# Altium schematic sheet TouchORkey.SchDoc
size A2
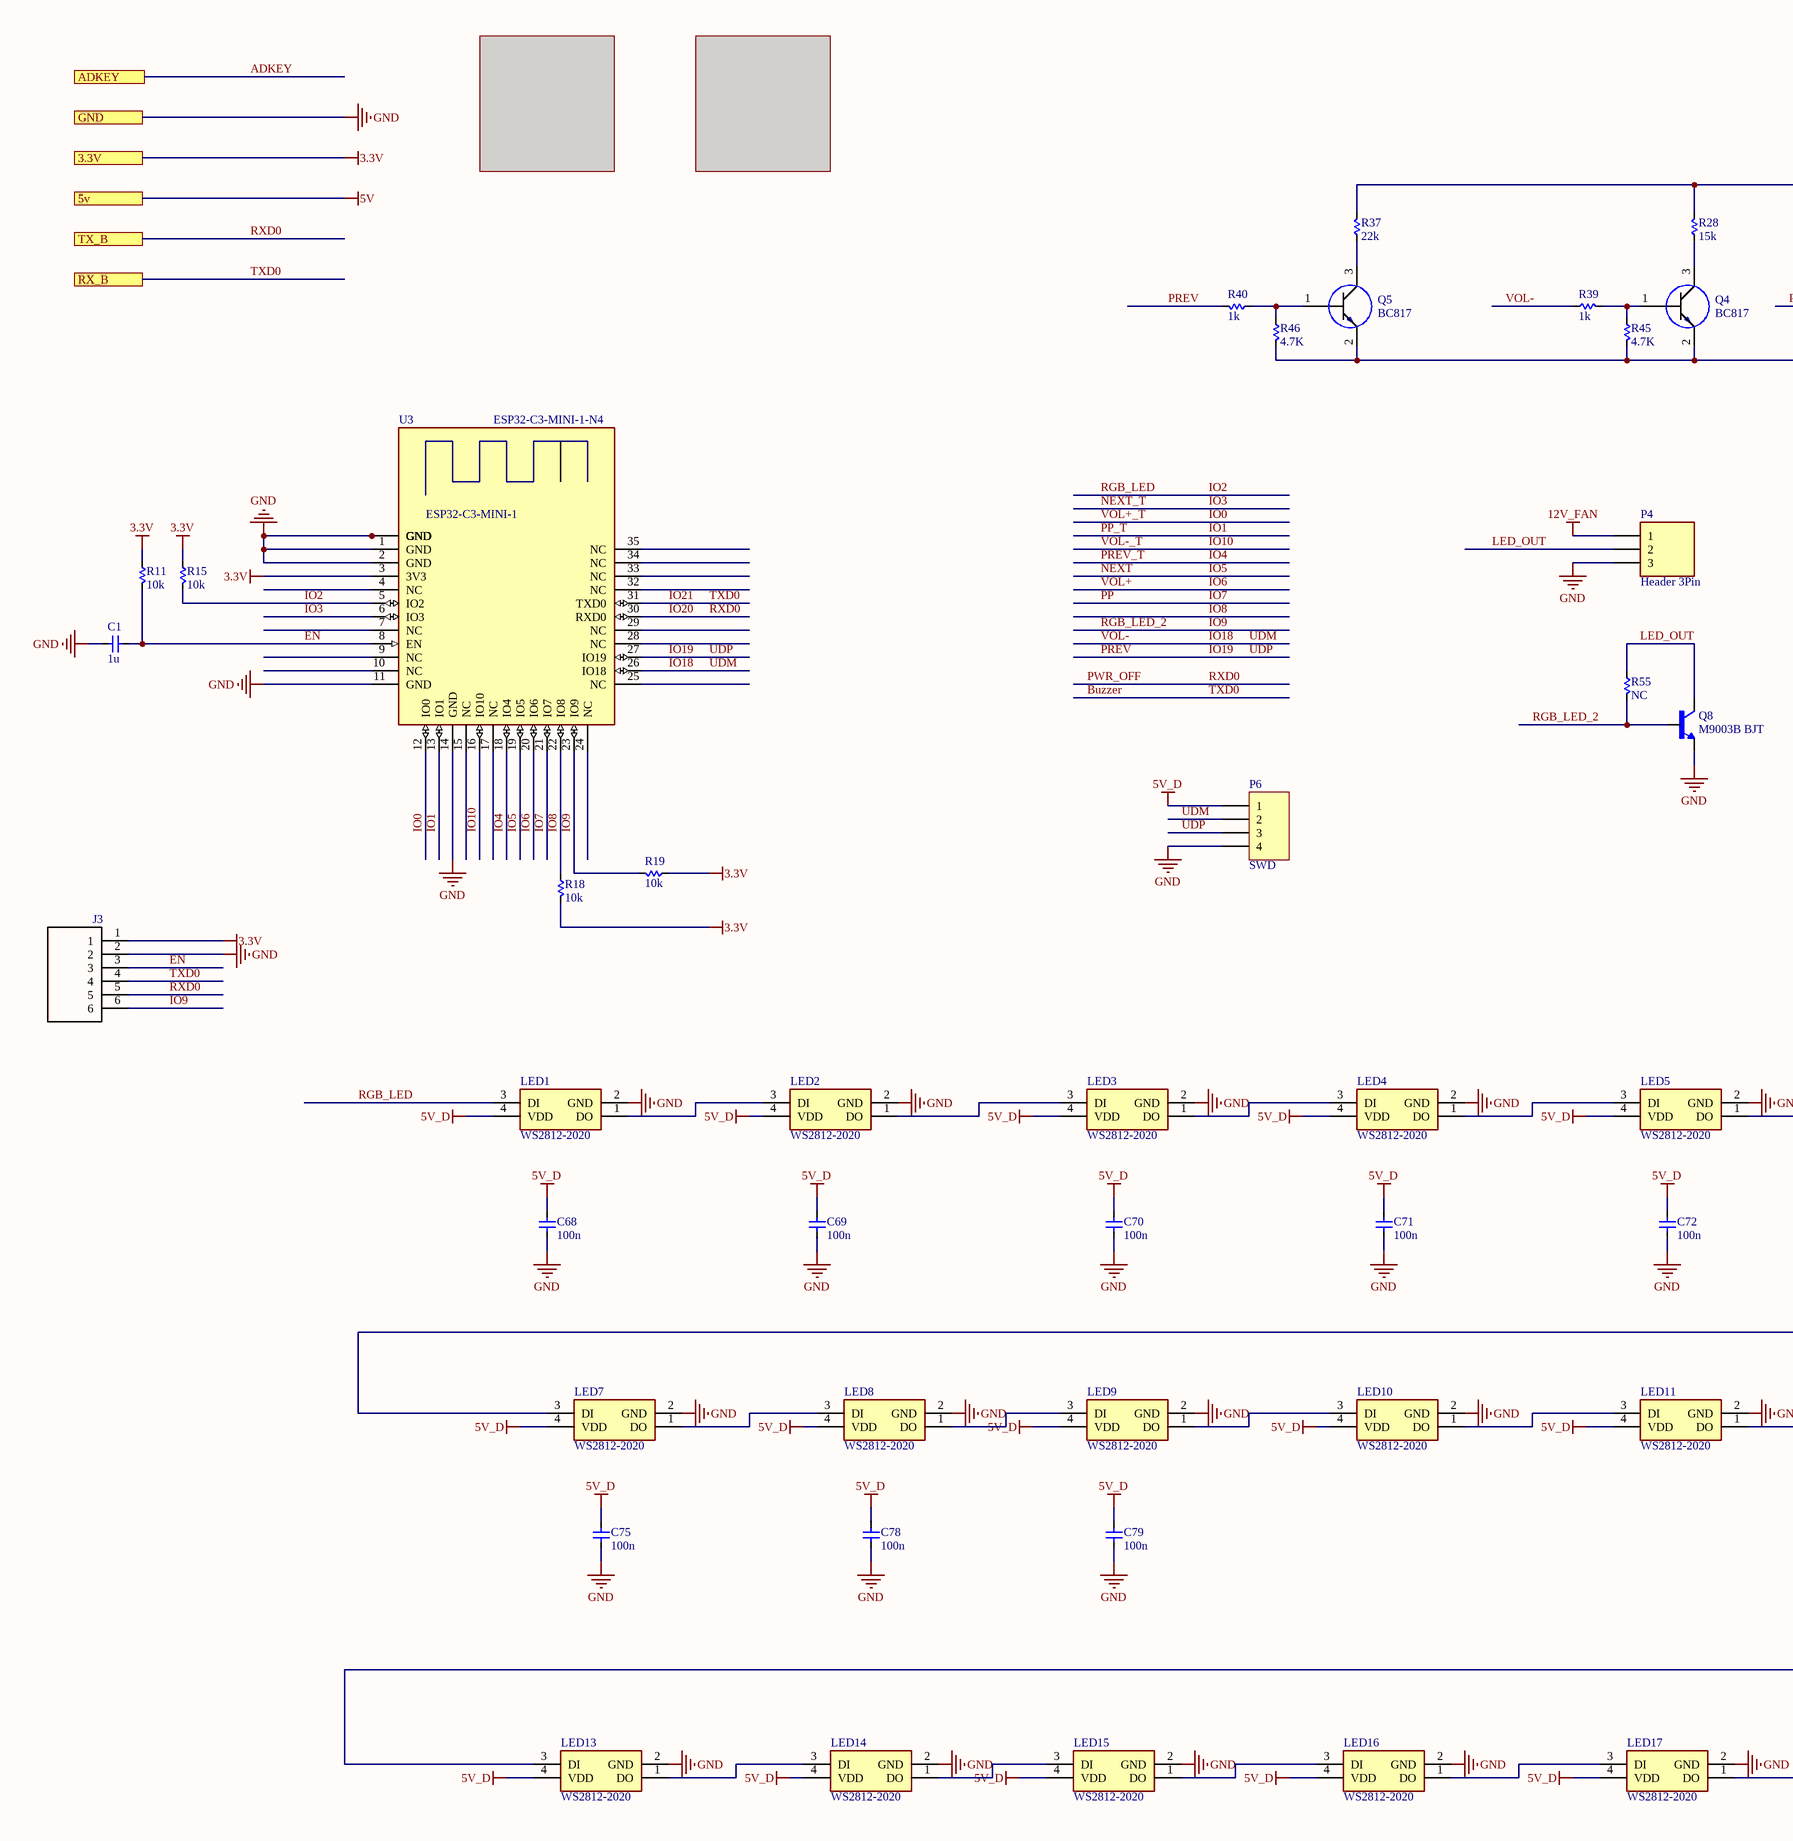
[diagram p0: TouchORkey.SchDoc, left]
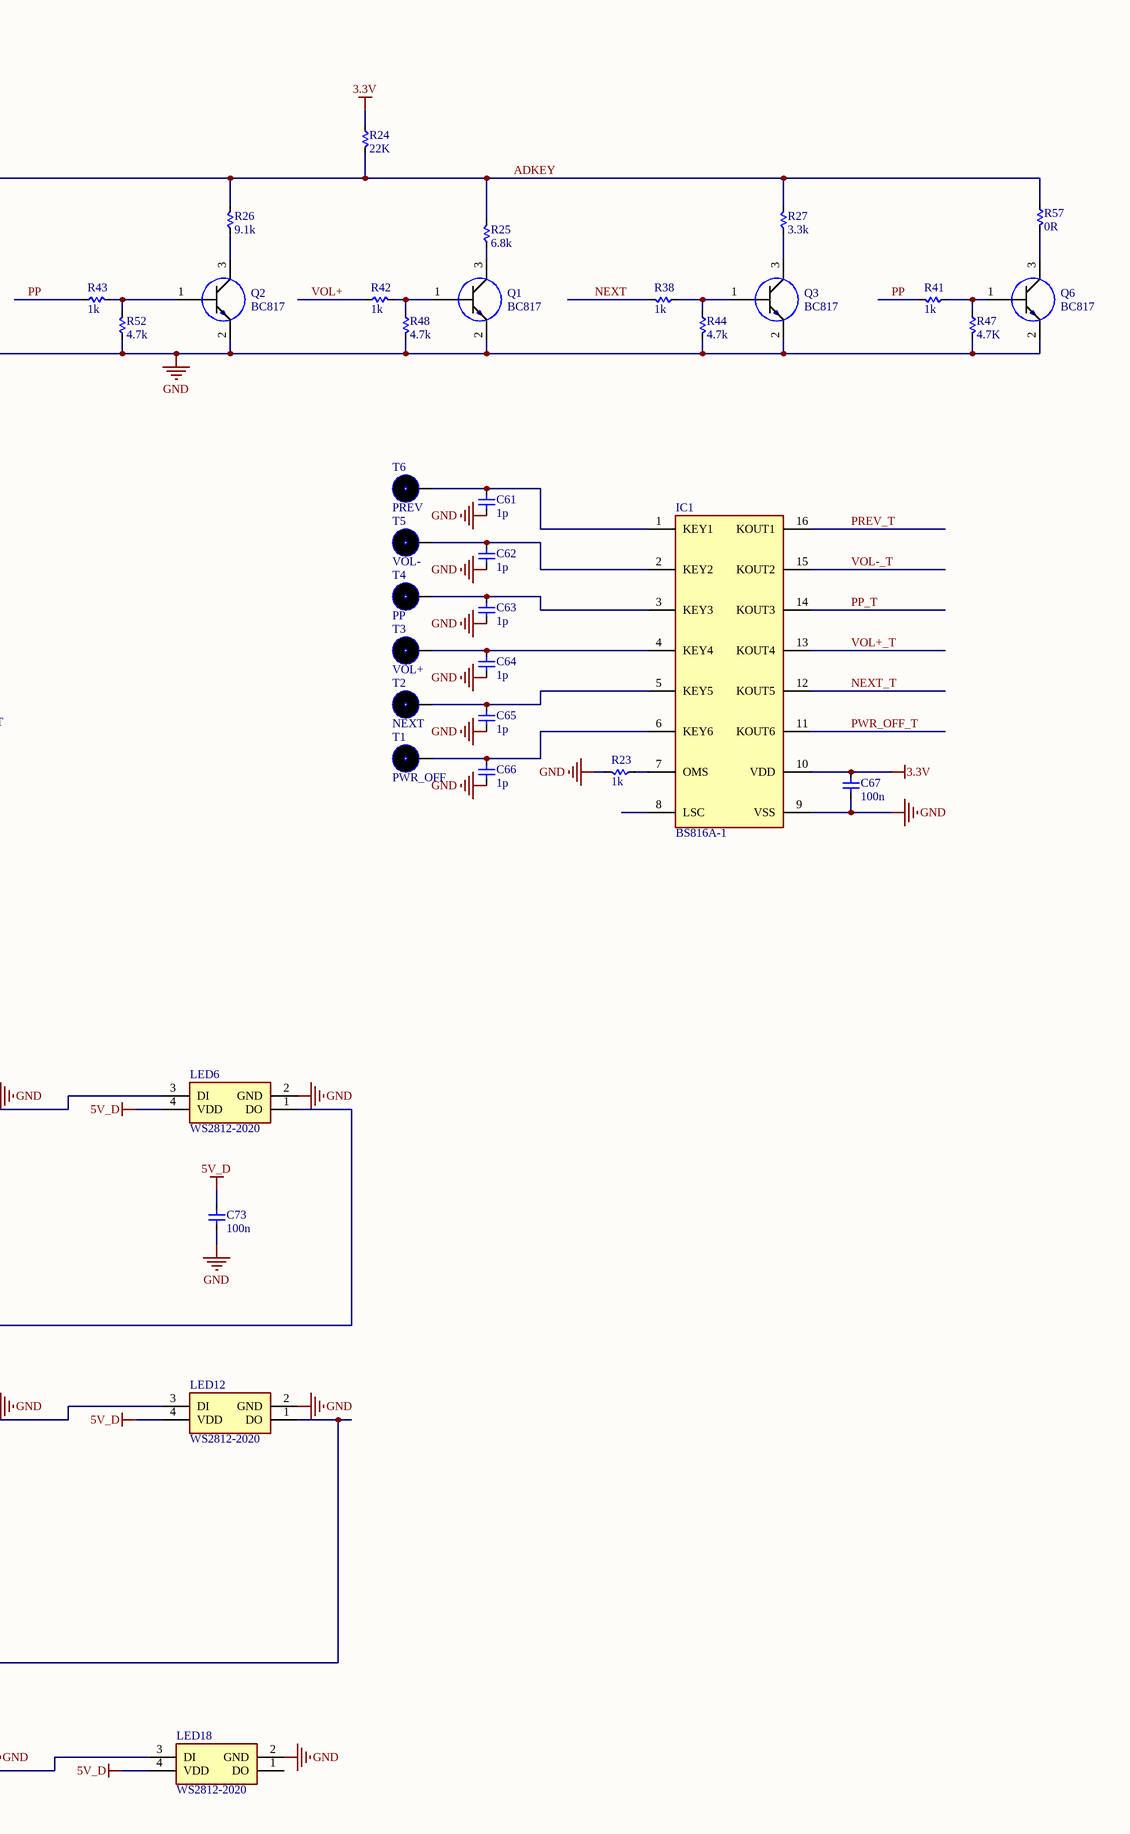
[diagram p1: TouchORkey.SchDoc, right]

## Parts
C1  1u  [cap0603]
C61  1p  [cap0603]
C62  1p  [cap0603]
C63  1p  [cap0603]
C64  1p  [cap0603]
C65  1p  [cap0603]
C66  1p  [cap0603]
C67  100n  [cap0603]
C68  100n  [cap0603]
C69  100n  [cap0603]
C70  100n  [cap0603]
C71  100n  [cap0603]
C72  100n  [cap0603]
C73  100n  [cap0603]
C75  100n  [cap0603]
C78  100n  [cap0603]
C79  100n  [cap0603]
IC1  BS816A-1  [BS816A-1]
J3  NC  [pin header1*6]  (value not drawn)
LED1  WS2812-2020  [WS28122020]
LED2  WS2812-2020  [WS28122020]
LED3  WS2812-2020  [WS28122020]
LED4  WS2812-2020  [WS28122020]
LED5  WS2812-2020  [WS28122020]
LED6  WS2812-2020  [WS28122020]
LED7  WS2812-2020  [WS28122020]
LED8  WS2812-2020  [WS28122020]
LED9  WS2812-2020  [WS28122020]
LED10  WS2812-2020  [WS28122020]
LED11  WS2812-2020  [WS28122020]
LED12  WS2812-2020  [WS28122020]
LED13  WS2812-2020  [WS28122020]
LED14  WS2812-2020  [WS28122020]
LED15  WS2812-2020  [WS28122020]
LED16  WS2812-2020  [WS28122020]
LED17  WS2812-2020  [WS28122020]
LED18  WS2812-2020  [WS28122020]
P4  Header 3Pin  [CONN-PHOENIX-3.81 3Pin]
P6  SWD  [HDR1X4H]
Q1  BC817  [BJT SS805]
Q2  BC817  [BJT SS805]
Q3  BC817  [BJT SS805]
Q4  BC817  [BJT SS805]
Q5  BC817  [BJT SS805]
Q6  BC817  [BJT SS805]
Q8  M9003B BJT  [M9003 BJT]
R11  10k  [RES-0603]
R15  10k  [RES-0603]
R18  10k  [RES-0603]
R19  10k  [RES-0603]
R23  1k  [RES-0603]
R24  22K  [RES-0603]
R25  6.8k  [RES-0603]
R26  9.1k  [RES-0603]
R27  3.3k  [RES-0603]
R28  15k  [RES-0603]
R37  22k  [RES-0603]
R38  1k  [RES-0603]
R39  1k  [RES-0603]
R40  1k  [RES-0603]
R41  1k  [RES-0603]
R42  1k  [RES-0603]
R43  1k  [RES-0603]
R44  4.7k  [RES-0603]
R45  4.7K  [RES-0603]
R46  4.7K  [RES-0603]
R47  4.7K  [RES-0603]
R48  4.7k  [RES-0603]
R52  4.7k  [RES-0603]
R55  NC  [RES-0603]
R57  0R  [RES-0603]
T1  PWR_OFF  [Touch pad CIRCULE - 5mm]
T2  NEXT  [Touch pad CIRCULE - 5mm]
T3  VOL+  [Touch pad CIRCULE - 5mm]
T4  PP  [Touch pad CIRCULE - 5mm]
T5  VOL-  [Touch pad CIRCULE - 5mm]
T6  PREV  [Touch pad CIRCULE - 5mm]
U3  ESP32-C3-MINI-1-N4  [ESP32-C3-MINI-1]

## Ports
3.3V, 5v, ADKEY, GND, RX_B, TX_B

## Nets
3.3V: C67.1 IC1.10(VDD) J3.1 R11.1 R15.1 R18.2 R19.1 R24.1 U3.3(3V3) ; port 3.3V
5V: port 5v
5V_D: C68.2 C69.2 C70.2 C71.2 C72.2 C73.2 C75.2 C78.2 C79.2 LED1.4(VDD) LED2.4(VDD) LED3.4(VDD) LED4.4(VDD) LED5.4(VDD) LED6.4(VDD) LED7.4(VDD) LED8.4(VDD) LED9.4(VDD) LED10.4(VDD) LED11.4(VDD) LED12.4(VDD) LED13.4(VDD) LED14.4(VDD) LED15.4(VDD) LED16.4(VDD) LED17.4(VDD) LED18.4(VDD) P6.1
12V_FAN: P4.1
GND: C1.1 C61.2 C62.2 C63.2 C64.2 C65.2 C66.2 C67.2 C68.1 C69.1 C70.1 C71.1 C72.1 C73.1 C75.1 C78.1 C79.1 IC1.9(VSS) J3.2 LED1.2(GND) LED2.2(GND) LED3.2(GND) LED4.2(GND) LED5.2(GND) LED6.2(GND) LED7.2(GND) LED8.2(GND) LED9.2(GND) LED10.2(GND) LED11.2(GND) LED12.2(GND) LED13.2(GND) LED14.2(GND) LED15.2(GND) LED16.2(GND) LED17.2(GND) LED18.2(GND) P4.3 P6.4 Q1.2(E) Q2.2(E) Q3.2(E) Q4.2(E) Q5.2(E) Q6.2(E) Q8.2(C) R23.2 R44.2 R45.2 R46.2 R47.2 R48.2 R52.1 U3.1(GND) U3.2(GND) U3.11(GND) U3.14(GND) U3.36(GND) U3.37(GND) U3.38(GND) U3.39(GND) U3.40(GND) U3.41(GND) U3.42(GND) U3.43(GND) U3.44(GND) U3.45(GND) U3.46(GND) U3.47(GND) U3.48(GND) U3.49_1(GND) U3.49_2(GND) U3.49_3(GND) U3.49_4(GND) U3.49_5(GND) U3.49_6(GND) U3.49_7(GND) U3.49_8(GND) U3.49_9(GND) U3.50(GND) U3.51(GND) U3.52(GND) U3.53(GND) ; port GND
ADKEY: R24.2 R25.2 R26.2 R27.2 R28.2 R37.2 R57.1 ; port ADKEY
Buzzer: J3.4 U3.31(TXD0) ; port RX_B  [also labelled IO21, TXD0]
EN: C1.2 J3.3 R11.2 U3.8(EN)
IO0: IC1.13(KOUT4) U3.12(IO0)  [also labelled VOL+_T]
IO1: IC1.14(KOUT3) U3.13(IO1)  [also labelled PP_T]
IO2: LED1.3(DI) R15.2 U3.5(IO2)  [also labelled RGB_LED]
IO3: IC1.12(KOUT5) U3.6(IO3)  [also labelled NEXT_T]
IO4: IC1.16(KOUT1) U3.18(IO4)  [also labelled PREV_T]
IO5: R38.2 U3.19(IO5)  [also labelled NEXT]
IO6: R42.1 U3.20(IO6)  [also labelled VOL+]
IO7: R41.2 R43.1 U3.21(IO7)  [also labelled PP]
IO8: R18.1 U3.22(IO8)
IO9: J3.6 Q8.1(B) R19.2 R55.2 U3.23(IO9)  [also labelled RGB_LED_2]
IO10: IC1.15(KOUT2) U3.16(IO10)  [also labelled VOL-_T]
IO18: P6.2 R39.1 U3.26(IO18)  [also labelled UDM, VOL-]
IO19: P6.3 R40.2 U3.27(IO19)  [also labelled PREV, UDP]
IO20: J3.5 U3.30(RXD0) ; port TX_B  [also labelled PWR_OFF, RXD0]
LED_OUT: P4.2 Q8.3(E) R55.1
PWR_OFF_T: IC1.11(KOUT6)
NetC61_1: C61.1 IC1.1(KEY1) T6.1
NetC62_1: C62.1 IC1.2(KEY2) T5.1
NetC63_1: C63.1 IC1.3(KEY3) T4.1
NetC64_1: C64.1 IC1.4(KEY4) T3.1
NetC65_1: C65.1 IC1.5(KEY5) T2.1
NetC66_1: C66.1 IC1.6(KEY6) T1.1
NetIC1_7: IC1.7(OMS) R23.1
NetLED1_1: LED1.1(DO) LED2.3(DI)
NetLED2_1: LED2.1(DO) LED3.3(DI)
NetLED3_1: LED3.1(DO) LED4.3(DI)
NetLED4_1: LED4.1(DO) LED5.3(DI)
NetLED5_1: LED5.1(DO) LED6.3(DI)
NetLED6_1: LED6.1(DO) LED7.3(DI)
NetLED7_1: LED7.1(DO) LED8.3(DI)
NetLED8_1: LED8.1(DO) LED9.3(DI)
NetLED9_1: LED9.1(DO) LED10.3(DI)
NetLED10_1: LED10.1(DO) LED11.3(DI)
NetLED11_1: LED11.1(DO) LED12.3(DI)
NetLED12_1: LED12.1(DO) LED13.3(DI)
NetLED13_1: LED13.1(DO) LED14.3(DI)
NetLED14_1: LED14.1(DO) LED15.3(DI)
NetLED15_1: LED15.1(DO) LED16.3(DI)
NetLED16_1: LED16.1(DO) LED17.3(DI)
NetLED17_1: LED17.1(DO) LED18.3(DI)
NetQ1_1: Q1.1(B) R42.2 R48.1
NetQ1_3: Q1.3(C) R25.1
NetQ2_1: Q2.1(B) R43.2 R52.2
NetQ2_3: Q2.3(C) R26.1
NetQ3_1: Q3.1(B) R38.1 R44.1
NetQ3_3: Q3.3(C) R27.1
NetQ4_1: Q4.1(B) R39.2 R45.1
NetQ4_3: Q4.3(C) R28.1
NetQ5_1: Q5.1(B) R40.1 R46.1
NetQ5_3: Q5.3(C) R37.1
NetQ6_1: Q6.1(B) R41.1 R47.1
NetQ6_3: Q6.3(C) R57.2

Not connected (* = marked no-connect by the designer): IC1 8(LSC); LED18 1(DO); U3 4(NC) 7(NC) 9(NC) 10(NC) 15(NC) 17(NC) 24(NC) 25(NC) 28(NC) 29(NC) 32(NC) 33(NC) 34(NC) 35(NC)

## Notes on the sheet
- (in symbol ESP32-C3-MINI-1-N4) ESP32-C3-MINI-1

## Library data of the parts
C1 C61-C73 C75 C78 C79 = Cap 0603: Capacitor 0603; Value: 104; Published: 8-Jun-2000; LatestRevisionDate: 17-Jul-2002; LatestRevisionNote: Re-released for DXP Platform.; Publisher: Altium Limited
IC1 = BS816A-1: 6_ch touch sensor 16-pin NSOP; Manufacturer_Name: Holtek; Datasheet Link: https://www.holtek.com/documents/10179/116711/BS81xA-xv150.pdf; Height: 1.75mm; Manufacturer_Part_Number: BS816A-1
J3 = pin header 06: Pin Connector 06 MODII HDR SRST B/A .100CL 6 POS; MF: TE Connectivity; MP: 5-146283-6; Price: None; SnapEDA_Link: https://www.snapeda.com/parts/5-146283-6/TE%20Connectivity%20AMP%20Connectors/view-part/?ref=snap; Availability: Unavailable; TE_purchase_URL: https://www.te.com/usa-en/product-5-146283-6.html?te_bu=Cor&te_type=disp&te_campaign=seda_glo_cor-seda-global-disp-prtnr-fy19-seda-model-bom-cta_sma-317_1&elqCampaignId=32493; Package: None; Value: *
LED1-LED18 = WS2812-2020: LED; Manufacturer_Name: Worldsemi; Datasheet Link: http://www.world-semi.com/DownLoadFile/140; Height: 0.84mm; Manufacturer_Part_Number: WS2812-2020
P4 = CONN-Phoenix-3.81 3Pin: Phoenix Connector 3.81; LatestRevisionDate: 17-Jul-2002; LatestRevisionNote: Re-released for DXP Platform.; Publisher: Altium Limited
P6 = pin header 1X4: Header, 4-Pin; LatestRevisionDate: 17-Jul-2002; LatestRevisionNote: Re-released for DXP Platform.; Publisher: Altium Limited
Q1-Q6 = SS8050-G BJT_ Transistor: Bipolar _BJT_ Transistor NPN 25V 1.5A 100MHz 300mW Surface Mount SOT-23; MF: Comchip Technology; SnapEDA_Link: https://www.snapeda.com/parts/SS8050-G/Comchip%20Technology/view-part/809142/?ref=snap; Price: None; MP: SS8050-G; Package: TO-236 Comchip; Availability: Unavailable; Value: *
Q8 = M9003B: Bipolar (BJT) Transistor NPN TO-252, (D-Pak); MF: Diodes Inc.; MP: 2DB1184Q-13; SnapEDA_Link: https://www.snapeda.com/parts/2DB1184Q-13/Diodes+Inc./view-part/?ref=snap; Package: TO-252-3 Diodes Inc.; Value: *; Check_prices: https://www.snapeda.com/parts/2DB1184Q-13/Diodes+Inc./view-part/?ref=eda
R11 R15 R18 R19 R23-R28 R37-R48 R52 R55 R57 = Res 0603: Resistor 0603; Published: 8-Jun-2000; LatestRevisionDate: 29-May-2009; LatestRevisionNote: IPC-7351 Footprint Added.; PackageReference: J1-0603; Publisher: Altium Limited; PackageDescription: Chip Resistor
  R11 R15 R24-R28 R37-R48 R52 R57: Value: *
T1-T6 = touch pad 5mm
U3 = ESP32-C3-MINI-1-N4: MF: {'manufacturer': u'Espressif Systems'}; Package: None; Price: None; Value: *; MP: ESP32-C3-MINI-1-N4; Availability: Unavailable